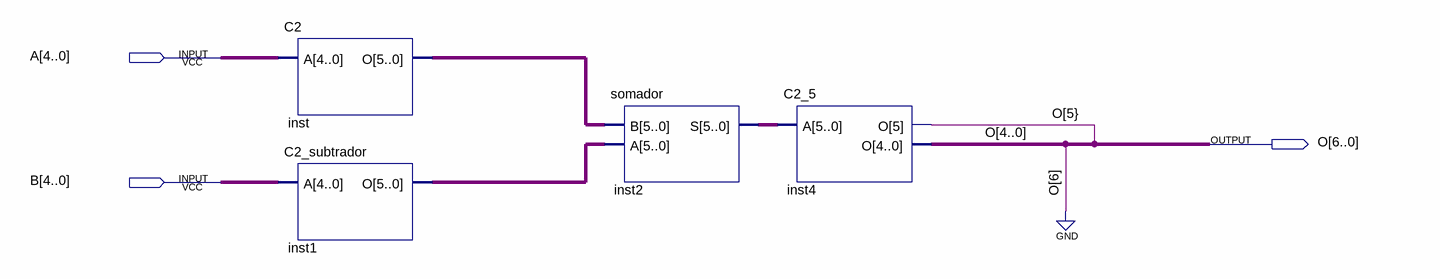
[diagram p0: schematic sheet]
// Quartus schematic subtrador.bdf as structural Verilog: 4 symbols, 3 pins
module subtrador (
  input  [4:0] A,
  input  [4:0] B,
  output [6:0] O
);

  wire \O[5} ;
  wire [5:0] inst1_o, inst2_s, inst_o;

  C2 inst (.A(A), .O(inst_o));
  C2_subtrador inst1 (.A(B), .O(inst1_o));
  somador inst2 (.B(inst_o), .A(inst1_o), .S(inst2_s));
  C2_5 inst4 (.A(inst2_s), .O({\O[5} , O[4:0]}));

  assign O[6] = 1'b0;
endmodule
